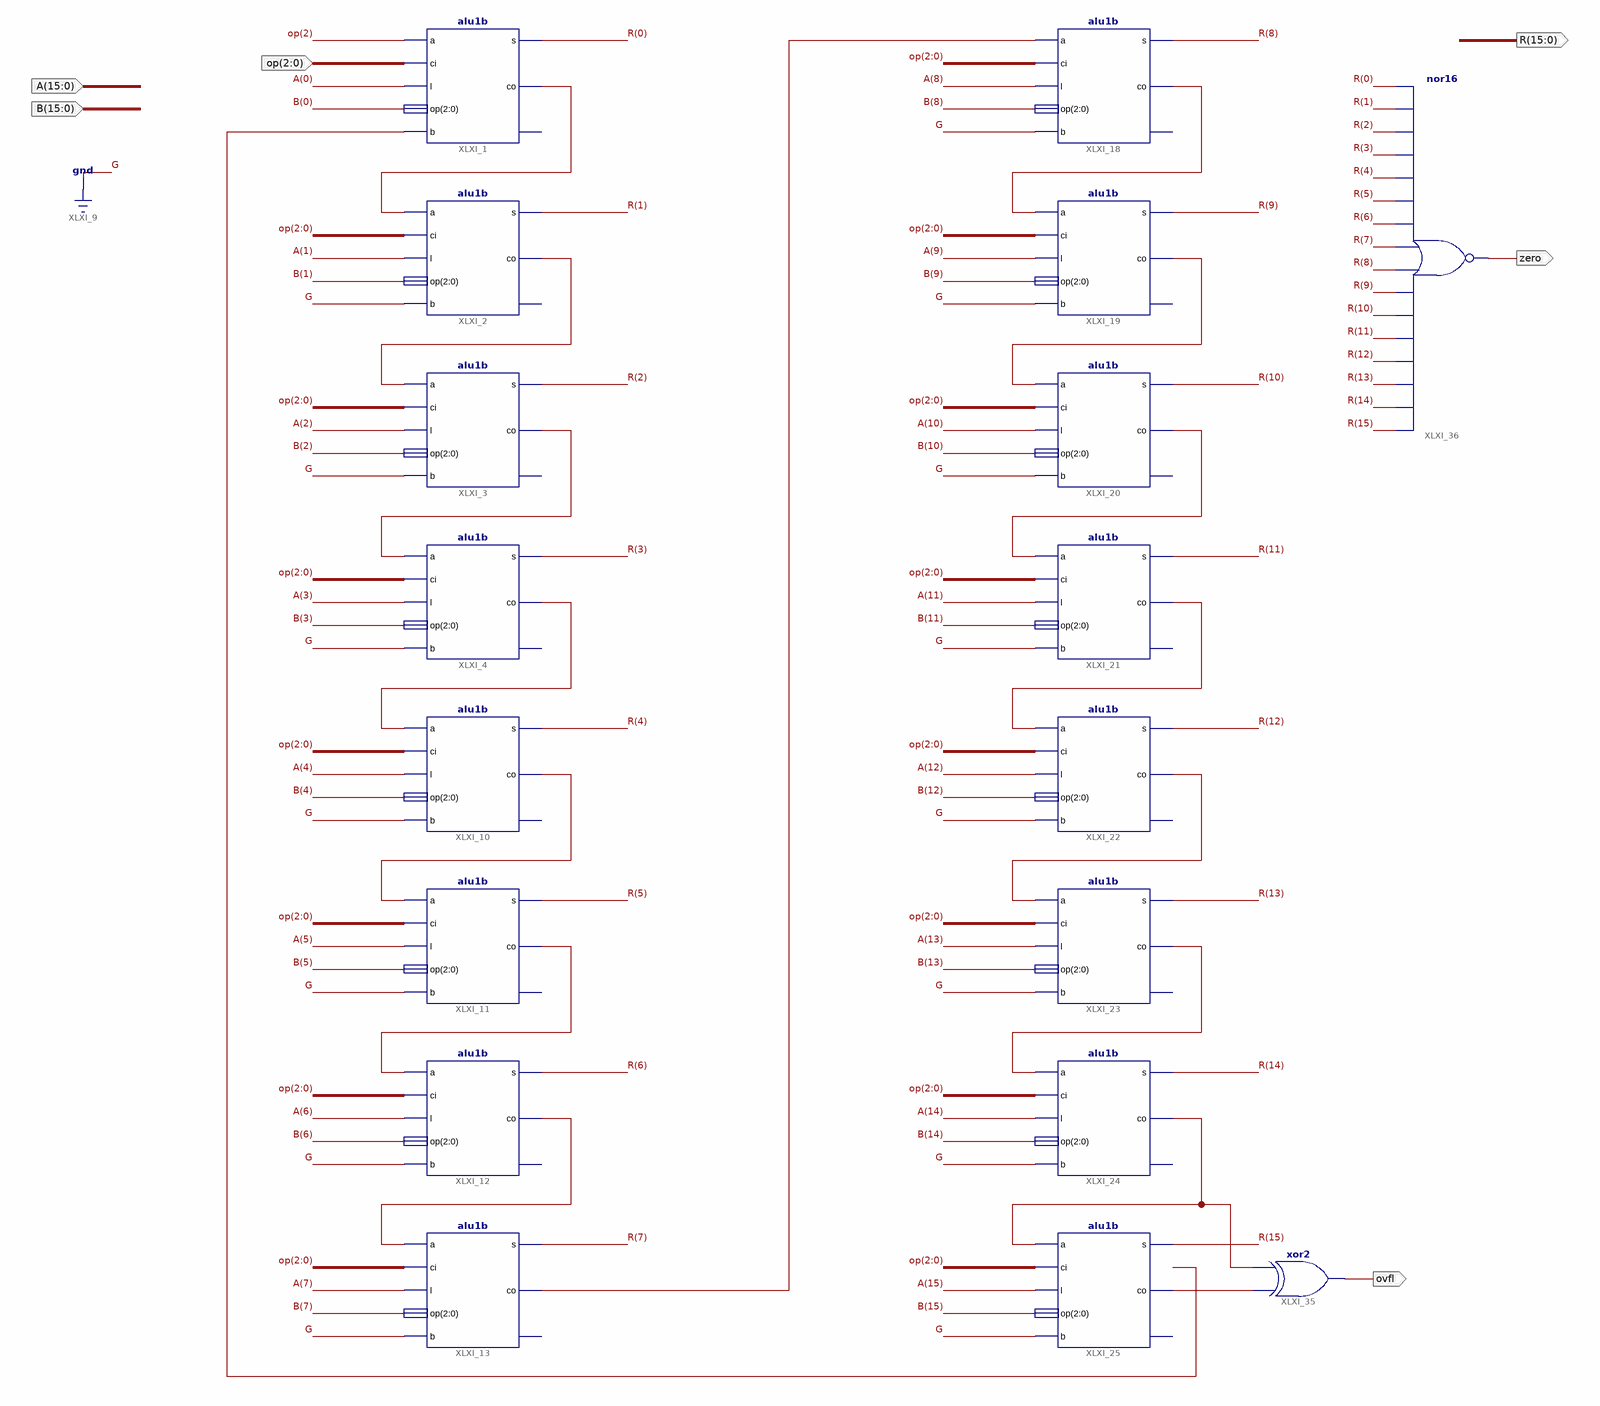
[diagram p0: schematic sheet 1]
// Xilinx ISE schematic alu16b.sch (spartan3e) as structural Verilog: 18 symbols, 7 ports
module alu16b (
  input  [2:0] op,
  input  [15:0] B,
  input  [15:0] A,
  output [15:0] R,
  output ovfl,
  output zero
);

  wire XLXN_1, XLXN_2, XLXN_3, XLXN_6, XLXN_8, XLXN_10, XLXN_63, XLXN_65, XLXN_67, XLXN_89, XLXN_91, XLXN_93,
       XLXN_174, XLXN_175, XLXN_176, XLXN_177, XLXN_181;

  alu1b XLXI_1 (.a(op[2]), .ci(op), .l(A[0]), .op({3{B[0]}}), .b(XLXN_177), .s(R[0]), .co(XLXN_1));  // open: r
  alu1b XLXI_2 (.a(XLXN_1), .ci(op), .l(A[1]), .op({3{B[1]}}), .b(1'b0), .s(R[1]), .co(XLXN_2));  // open: r
  alu1b XLXI_3 (.a(XLXN_2), .ci(op), .l(A[2]), .op({3{B[2]}}), .b(1'b0), .s(R[2]), .co(XLXN_3));  // open: r
  alu1b XLXI_4 (.a(XLXN_3), .ci(op), .l(A[3]), .op({3{B[3]}}), .b(1'b0), .s(R[3]), .co(XLXN_175));  // open: r
  alu1b XLXI_10 (.a(XLXN_175), .ci(op), .l(A[4]), .op({3{B[4]}}), .b(1'b0), .s(R[4]), .co(XLXN_6));  // open: r
  alu1b XLXI_11 (.a(XLXN_6), .ci(op), .l(A[5]), .op({3{B[5]}}), .b(1'b0), .s(R[5]), .co(XLXN_8));  // open: r
  alu1b XLXI_12 (.a(XLXN_8), .ci(op), .l(A[6]), .op({3{B[6]}}), .b(1'b0), .s(R[6]), .co(XLXN_10));  // open: r
  alu1b XLXI_13 (.a(XLXN_10), .ci(op), .l(A[7]), .op({3{B[7]}}), .b(1'b0), .s(R[7]), .co(XLXN_176));  // open: r
  alu1b XLXI_18 (.a(XLXN_176), .ci(op), .l(A[8]), .op({3{B[8]}}), .b(1'b0), .s(R[8]), .co(XLXN_63));  // open: r
  alu1b XLXI_19 (.a(XLXN_63), .ci(op), .l(A[9]), .op({3{B[9]}}), .b(1'b0), .s(R[9]), .co(XLXN_65));  // open: r
  alu1b XLXI_20 (.a(XLXN_65), .ci(op), .l(A[10]), .op({3{B[10]}}), .b(1'b0), .s(R[10]), .co(XLXN_67));  // open: r
  alu1b XLXI_21 (.a(XLXN_67), .ci(op), .l(A[11]), .op({3{B[11]}}), .b(1'b0), .s(R[11]), .co(XLXN_174));  // open: r
  alu1b XLXI_22 (.a(XLXN_174), .ci(op), .l(A[12]), .op({3{B[12]}}), .b(1'b0), .s(R[12]), .co(XLXN_89));  // open: r
  alu1b XLXI_23 (.a(XLXN_89), .ci(op), .l(A[13]), .op({3{B[13]}}), .b(1'b0), .s(R[13]), .co(XLXN_91));  // open: r
  alu1b XLXI_24 (.a(XLXN_91), .ci(op), .l(A[14]), .op({3{B[14]}}), .b(1'b0), .s(R[14]), .co(XLXN_93));  // open: r
  alu1b XLXI_25 (.a(XLXN_93), .ci(op), .l(A[15]), .op({3{B[15]}}), .b(1'b0), .s(R[15]), .co(XLXN_181));  // open: r
  xor XLXI_35 (ovfl, XLXN_181, XLXN_93);
  nor XLXI_36 (zero, R[15], R[14], R[13], R[12], R[11], R[10], R[9], R[8], R[7], R[6], R[5], R[4], R[3], R[2], R[1], R[0]);
endmodule
